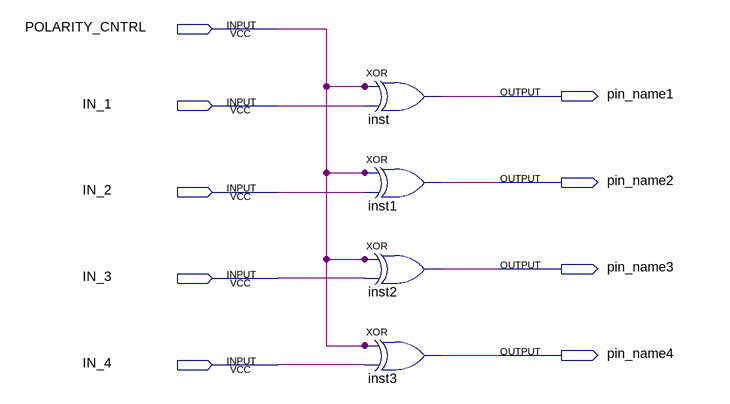
[diagram p0: schematic sheet]
// Quartus schematic schem_polarity_gates.bdf as structural Verilog: 4 symbols, 9 pins
module schem_polarity_gates (
  input  POLARITY_CNTRL,
  input  IN_1,
  input  IN_2,
  input  IN_3,
  input  IN_4,
  output pin_name1,
  output pin_name2,
  output pin_name3,
  output pin_name4
);

  xor inst (pin_name1, POLARITY_CNTRL, IN_1);
  xor inst1 (pin_name2, POLARITY_CNTRL, IN_2);
  xor inst2 (pin_name3, POLARITY_CNTRL, IN_3);
  xor inst3 (pin_name4, POLARITY_CNTRL, IN_4);
endmodule
